# Altium project IC_circuit.PrjPcb
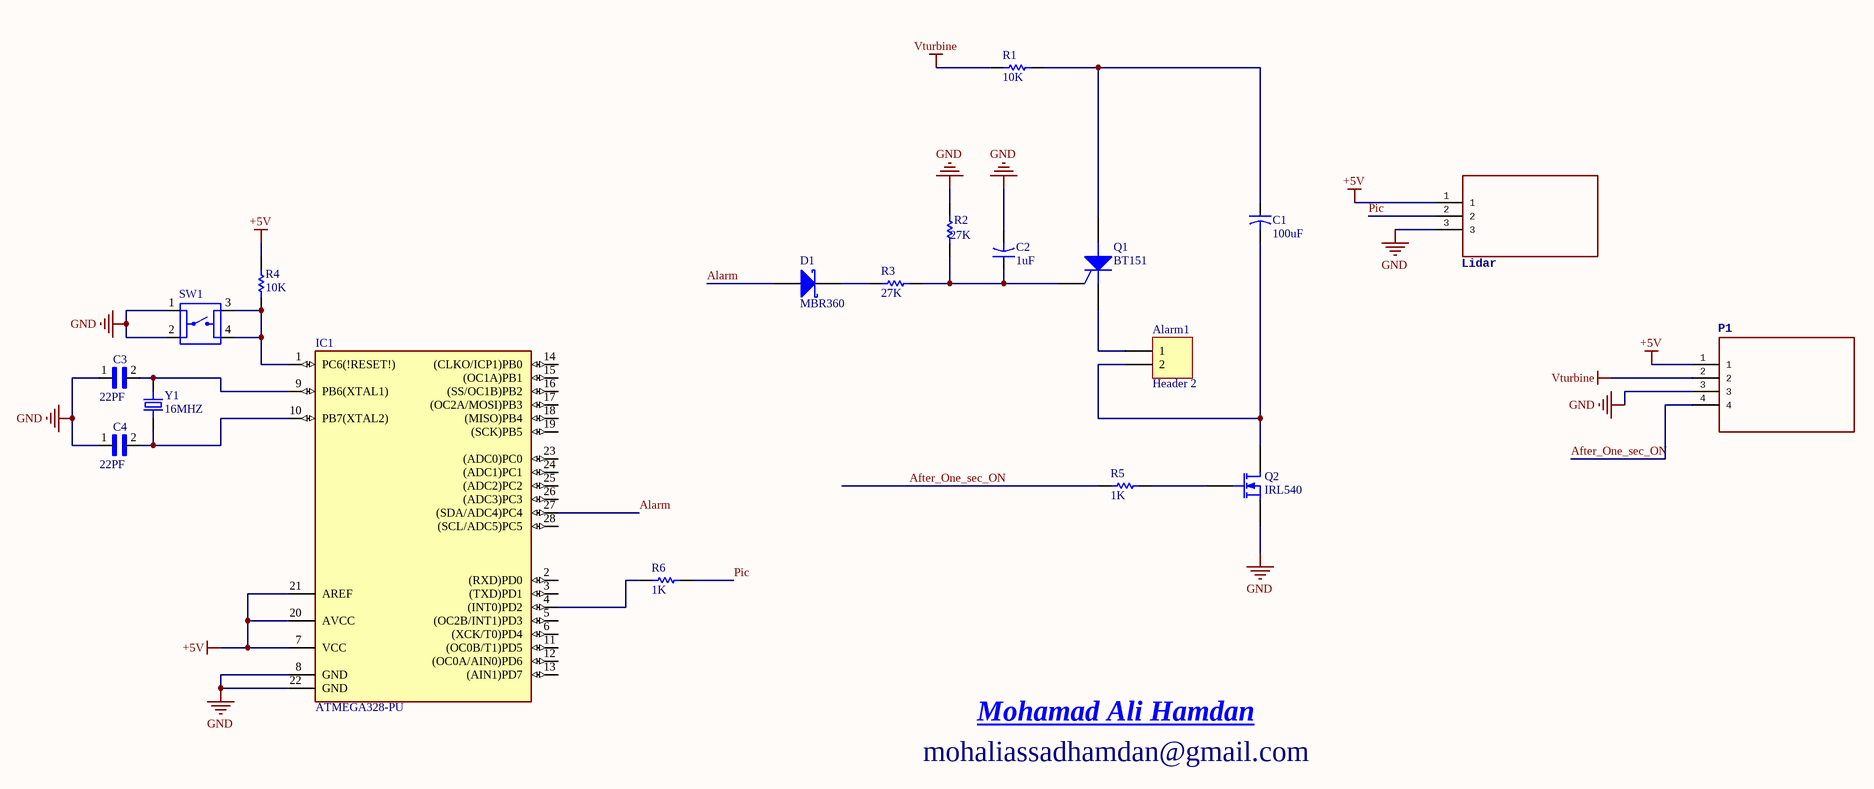
[diagram p0: IC_Sheet1.SchDoc]
1 sheet, 19 parts. Net scope: global (net labels, ports and power ports of the same name join across sheets).
Board file: IC_PCB1.PcbDoc

## Sheet IC_Sheet1.SchDoc
size A2

### Parts
Alarm1  Header 2  [Connector_green_2pins]
C1  value 100uF  [Capacitor_polarized_100uF]  (hidden comment: Cap2)
C2  value 1uF  [Capacitor_polarized_100uF]  (hidden comment: Cap2)
C3  BuyPart: 22PF  [CAP_RDER71H333K0M1H03A]  (hidden comment: 14pF)
C4  BuyPart: 22PF  [CAP_RDER71H333K0M1H03A]  (hidden comment: 14pF)
D1  MBR360  [diode 4007]
IC1  ATMEGA328-PU  [DIL28]
Lidar  SAMTEC-HTSW-103-07-X-SJ  [SAMTEC-HTSW-103-07-X-S]  (value not drawn)
P1  SAMTEC-HTSW-104-14-X-SJ  [SAMTEC-HTSW-104-14-X-S]  (value not drawn)
Q1  BT151  [TO255P1040X460X1975-3]
Q2  IRL540  [TO254P1054X470X1955-3]
R1  value 10K  [resistor]  (hidden comment: Res1)
R2  value 27K  [resistor]  (hidden comment: Res1)
R3  value 27K  [resistor]  (hidden comment: Res1)
R4  value 10K  [resistor]  (hidden comment: Res1)
R5  value 1K  [resistor]  (hidden comment: Res1)
R6  value 1K  [resistor]  (hidden comment: Res1)
SW1  FSM8JH  [SW_FSM8JH]  (value not drawn)
Y1  16MHZ  [XTAL_ECS-160-20-4VX]

### Nets
+5V: IC1.7(VCC) IC1.20(AVCC) IC1.21(AREF) Lidar.1 P1.1 R4.2
GND: C2.2 C3.1 C4.1 IC1.8(GND) IC1.22(GND) Lidar.3 P1.3 Q2.3(S) R2.2 SW1.1 SW1.2
Vturbine: P1.2 R1.2
After_One_sec_ON: P1.4 R5.2
Alarm: D1.3(A) IC1.27((SDA/ADC4)PC4)
Pic: Lidar.2 R6.1
NetAlarm1_1: Alarm1.1 Q1.3(K)
NetAlarm1_2: Alarm1.2 C1.2 Q2.1(D)
NetC1_1: C1.1 Q1.1(A) R1.1
NetC2_1: C2.1 Q1.2(G) R2.1 R3.1
NetC3_2: C3.2 IC1.9(PB6(XTAL1)) Y1.2
NetC4_2: C4.2 IC1.10(PB7(XTAL2)) Y1.1
NetD1_1: D1.1(K) R3.2
NetIC1_1: IC1.1(PC6(!RESET!)) R4.1 SW1.3 SW1.4
NetIC1_4: IC1.4((INT0)PD2) R6.2
NetQ2_2: Q2.2(G) R5.1

Not connected (* = marked no-connect by the designer): IC1 2((RXD)PD0) 3((TXD)PD1) 5((OC2B/INT1)PD3) 6((XCK/T0)PD4) 11((OC0B/T1)PD5) 12((OC0A/AIN0)PD6) 13((AIN1)PD7) 14((CLKO/ICP1)PB0) 15((OC1A)PB1) 16((SS/OC1B)PB2) 17((OC2A/MOSI)PB3) 18((MISO)PB4) 19((SCK)PB5) 23((ADC0)PC0) 24((ADC1)PC1) 25((ADC2)PC2) 26((ADC3)PC3) 28((SCL/ADC5)PC5)

### Notes on the sheet
- mohaliassadhamdan@gmail.com
- Mohamad Ali Hamdan

### Library data of the parts
Alarm1 = Header 2: Header, 2-Pin; LatestRevisionDate: 17-Jul-2002; LatestRevisionNote: Re-released for DXP Platform.; Publisher: Altium Limited
C1 C2 = Cap2: Capacitor; pin to pad: 1>+ 2>-; Published: 23-Sep-2002; PackageReference: CAPR5-4X5; Publisher: Altium Limited; PackageDescription: Capacitor; 2 Leads
C3 C4 = RDER71H333K0M1H03A: Lead capacitor X7R(EIA) with Capacitance 33000pF, Rated Voltage 50Vdc; MF: Murata; SnapEDA_Link: https://www.snapeda.com/parts/RDER71H333K0M1H03A/Murata/view-part/4546735/?ref=snap; Availability: Warning; Price: None; Package: Radial Murata; Value: *; MP: RDER71H333K0M1H03A; Mouser-Purchase-URL: https://snapeda.com/shop?store=Mouser&id=4546735
D1 = Diode 10TQ035: Schottky Rectifier; pin to pad: 3>2; Note: Terminal 2 is the TAB and is electrically connected to the cathode; Published: 8-Jun-2000; LatestRevisionDate: 17-Jul-2002; LatestRevisionNote: Re-released for DXP Platform.; DatasheetVersion: PD-2.057B; PackageVersion: Feb-1998; PackageReference: TO-220AC; Publisher: Altium Limited; PackageDescription: TO, Thru-Hole, Vertical, Heatsink Mounted; 3 In-Line Leads (1 Absent); Pitch 2.54 mm; ComponentLink1Description: Manufacturer Link; ComponentLink1URL: http://www.irf.com/; ComponentLink2Description: Datasheet; ComponentLink2URL: http://www.irf.com/product-info/datasheets/data/10tq.pdf
IC1 = ATMEGA328-PU: AVR AVRÂ® ATmega Microcontroller IC 8-Bit 20MHz 32KB _16K x 16_ FLASH 28-PDIP; MF: Microchip Technology; Package: DIP-28 Microchip Technology; Price: None; Availability: Unavailable; MP: ATMEGA328-PU; SnapEDA_Link: https://www.snapeda.com/parts/ATMEGA328-PU/Microchip/view-part/4327846/?ref=snap; Value: *
Q1 = SCR: Silicon Controlled Rectifier; Published: 8-Jun-2000; LatestRevisionDate: 17-Jul-2002; LatestRevisionNote: Re-released for DXP Platform.; PackageReference: TO-220-AB; Publisher: Altium Limited; Code_JEDEC: TO-220-AB
Q2 = MOSFET-N: N-Channel MOSFET; Published: 8-Jun-2000; LatestRevisionDate: 17-Jul-2002; LatestRevisionNote: Re-released for DXP Platform.; PackageVersion: 1995/1996; PackageReference: E3; Publisher: Altium Limited; PackageDescription: TO, Flat Index; 3 In-Line, Axial Leads; Body Dia. 4.6mm; Lead Dia. 0.5 mm (max)
R1-R6 = Res1: Resistor; Published: 8-Jun-2000; LatestRevisionDate: 17-Jul-2002; LatestRevisionNote: Re-released for DXP Platform.; PackageReference: AXIAL-0.3; Publisher: Altium Limited; PackageDescription: Axial Device, Thru-Hole; 2 Leads; 0.3 in Pin Spacing
SW1 = FSM8JH: Tactile Switch SPST-NO Top Actuated Through Hole; MF: TE Connectivity; MP: FSM8JH; SnapEDA_Link: https://www.snapeda.com/parts/FSM8JH/TE%20Connectivity%20ALCOSWITCH%20Switches/view-part/139741/?ref=snap; Price: None; Package: None; TE_purchase_URL: https://www.te.com/usa-en/product-FSM8JH.html?te_bu=Cor&te_type=disp&te_campaign=seda_glo_cor-seda-global-disp-prtnr-fy19-seda-model-bom-cta_sma-317_1&elqCampaignId=32493; Value: *; Availability: Unavailable
Y1 = ECS-160-20-4VX: 16MHz Â±30ppm Crystal 20pF 50 Ohms HC-49/US; MF: ECS Inc.; SnapEDA_Link: https://www.snapeda.com/parts/ECS-160-20-4VX/ECS%20Inc./view-part/47293/?ref=snap; Availability: Unavailable; Value: *; Price: None; MP: ECS-160-20-4VX; Package: HC49/US ECS International